# EAGLE schematic LED-driver I2C (EAGLE 6.3)
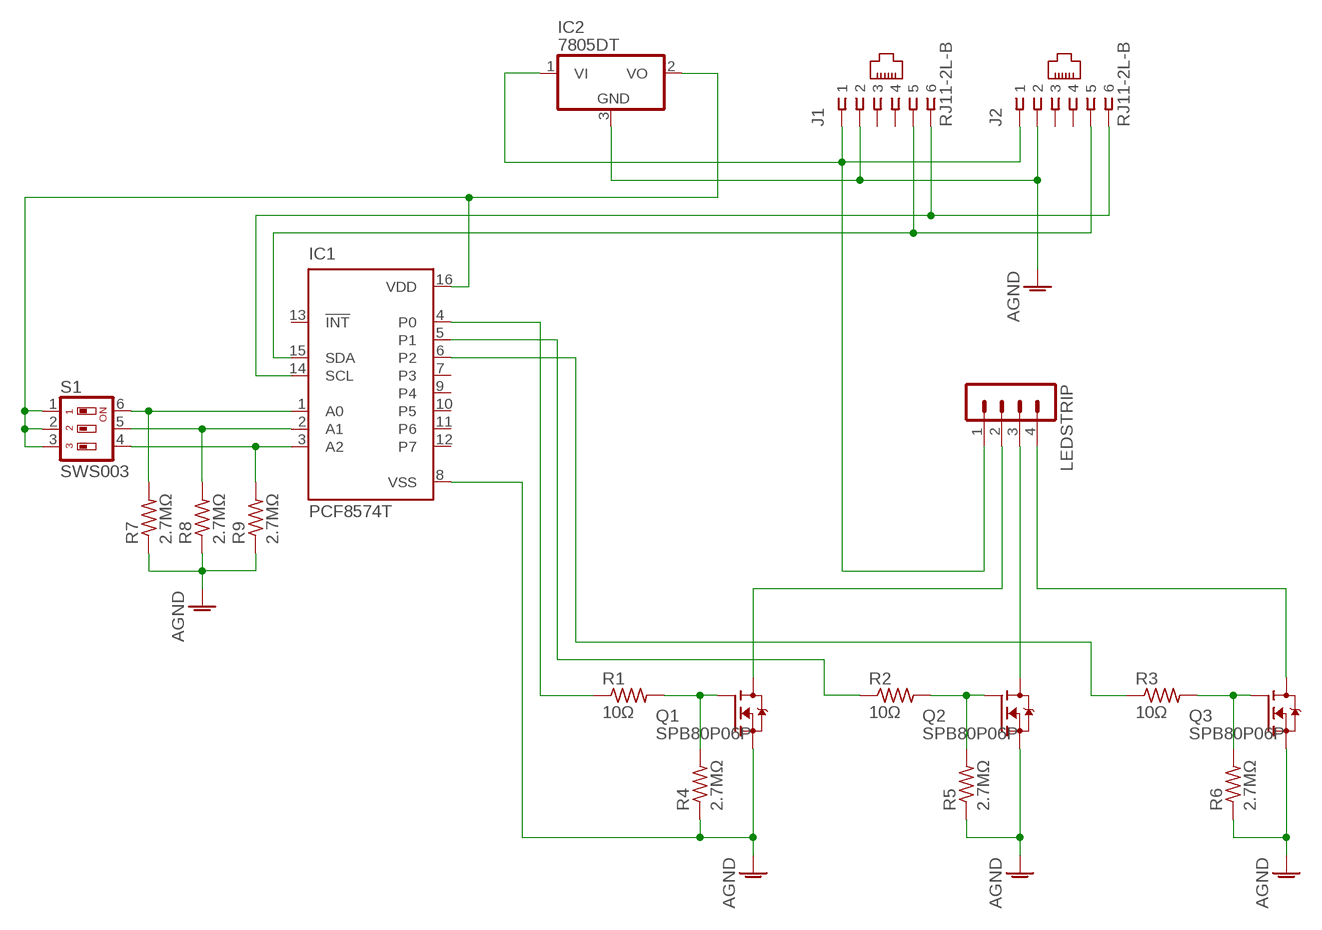
[diagram p0: schematic, sheet 1]

## Parts
IC1  PCF8574T  [SO16W]
IC2  7805DT  [TO252]
J1  RJ11-2L-B  [RJ11-NO_SHIELD]
J2  RJ11-2L-B  [RJ11-NO_SHIELD]
LEDSTRIP  MA04-1  [MA04-1]
Q1  SPB80P06P  [TO263]
Q2  SPB80P06P  [TO263]
Q3  SPB80P06P  [TO263]
R1  10Ω  R-US_R0402  [R0402]
R2  10Ω  R-US_R0402  [R0402]
R3  10Ω  R-US_R0402  [R0402]
R4  2.7MΩ  R-US_R0402  [R0402]
R5  2.7MΩ  R-US_R0402  [R0402]
R6  2.7MΩ  R-US_R0402  [R0402]
R7  2.7MΩ  R-US_R0402  [R0402]
R8  2.7MΩ  R-US_R0402  [R0402]
R9  2.7MΩ  R-US_R0402  [R0402]
S1  SWS003  [SMS-003]

## Nets
AGND: IC1.8(VSS) IC2.3(GND) J1.2 J2.2 Q1.2(D) Q2.2(D) Q3.2(D) R4.1 R5.1 R6.1 R7.1 R8.1 R9.1
N$1: IC1.15(SDA) J1.5 J2.5
N$2: IC1.14(SCL) J1.6 J2.6
N$4: Q1.1(G) R1.2 R4.2
N$5: Q2.1(G) R2.2 R5.2
N$6: Q3.1(G) R3.2 R6.2
N$7: LEDSTRIP.2 Q1.3(S)
N$8: LEDSTRIP.3 Q2.3(S)
N$9: LEDSTRIP.4 Q3.3(S)
N$10: IC2.1(VI) J1.1 J2.1 LEDSTRIP.1
N$12: IC1.1(A0) R7.2 S1.6
N$13: IC1.2(A1) R8.2 S1.5
N$14: IC1.3(A2) R9.2 S1.4
N$15: IC1.16(VDD) IC2.2(VO) S1.1 S1.2 S1.3
N$16: IC1.4(P0) R1.1
N$17: IC1.5(P1) R2.1
N$18: IC1.6(P2) R3.1
Unconnected: IC1.7(P3) IC1.9(P4) IC1.10(P5) IC1.11(P6) IC1.12(P7) IC1.13(!INT) J1.3 J1.4 J2.3 J2.4

## Library data of the parts
IC1 = micro-philips:PCF8574: I2C-Bus Remote 8-bit I/O expander http://www.semiconductors.philips.com/acrobat_download/datasheets/PCF8574_4.pdf; MPN: PCF8574T/3,512; OC_FARNELL: 1201255; OC_NEWARK: 70R6870
IC2 = linear:78*: Positive VOLTAGE REGULATOR Source: http://cache.national.com/ds/LM/LM78L05.pdf http://www.fairchildsemi.com/ds/LM/LM7805.pdf
J1 J2 = con-tycoelectronics:RJ11: CORCOM Modular RJ Jacks No Shield Source: www.tycoelectronics.com .. ENG_DS_1654001_1099_RJ_L_0507.pdf; MF: TYCO ELECTRONICS; MPN: RJ11-2L-B; OC_FARNELL: unknown; OC_NEWARK: 83F4463
LEDSTRIP = con-lstb:MA04-1: PIN HEADER; OC_FARNELL: unknown; OC_NEWARK: unknown
Q1-Q3 = F3205S:SPB80P06P: SIPMOS (R) Power-Transistor P-Channel, Enhancement mode Source: http://www.infineon.com/upload/Document/cmc_upload/documents/011/3685/SPP80P06P.pdf
R1-R9 = rcl:R-US_: RESISTOR, American symbol
S1 = smd-special:SWS003: SMD Dip Switch 3 pol.